# EasyEDA Pro project Laser Monitor.eprj, schematic Main Board Schematic

## Sheets
1 Pressure Transducer: Board Name: Main Board; Create Date: 2026-01-24; Page Name: Pressure Transducer; Project Name: Laser Monitor; Schematic Name: Main Board Schematic; Update Date: 2026-01-27
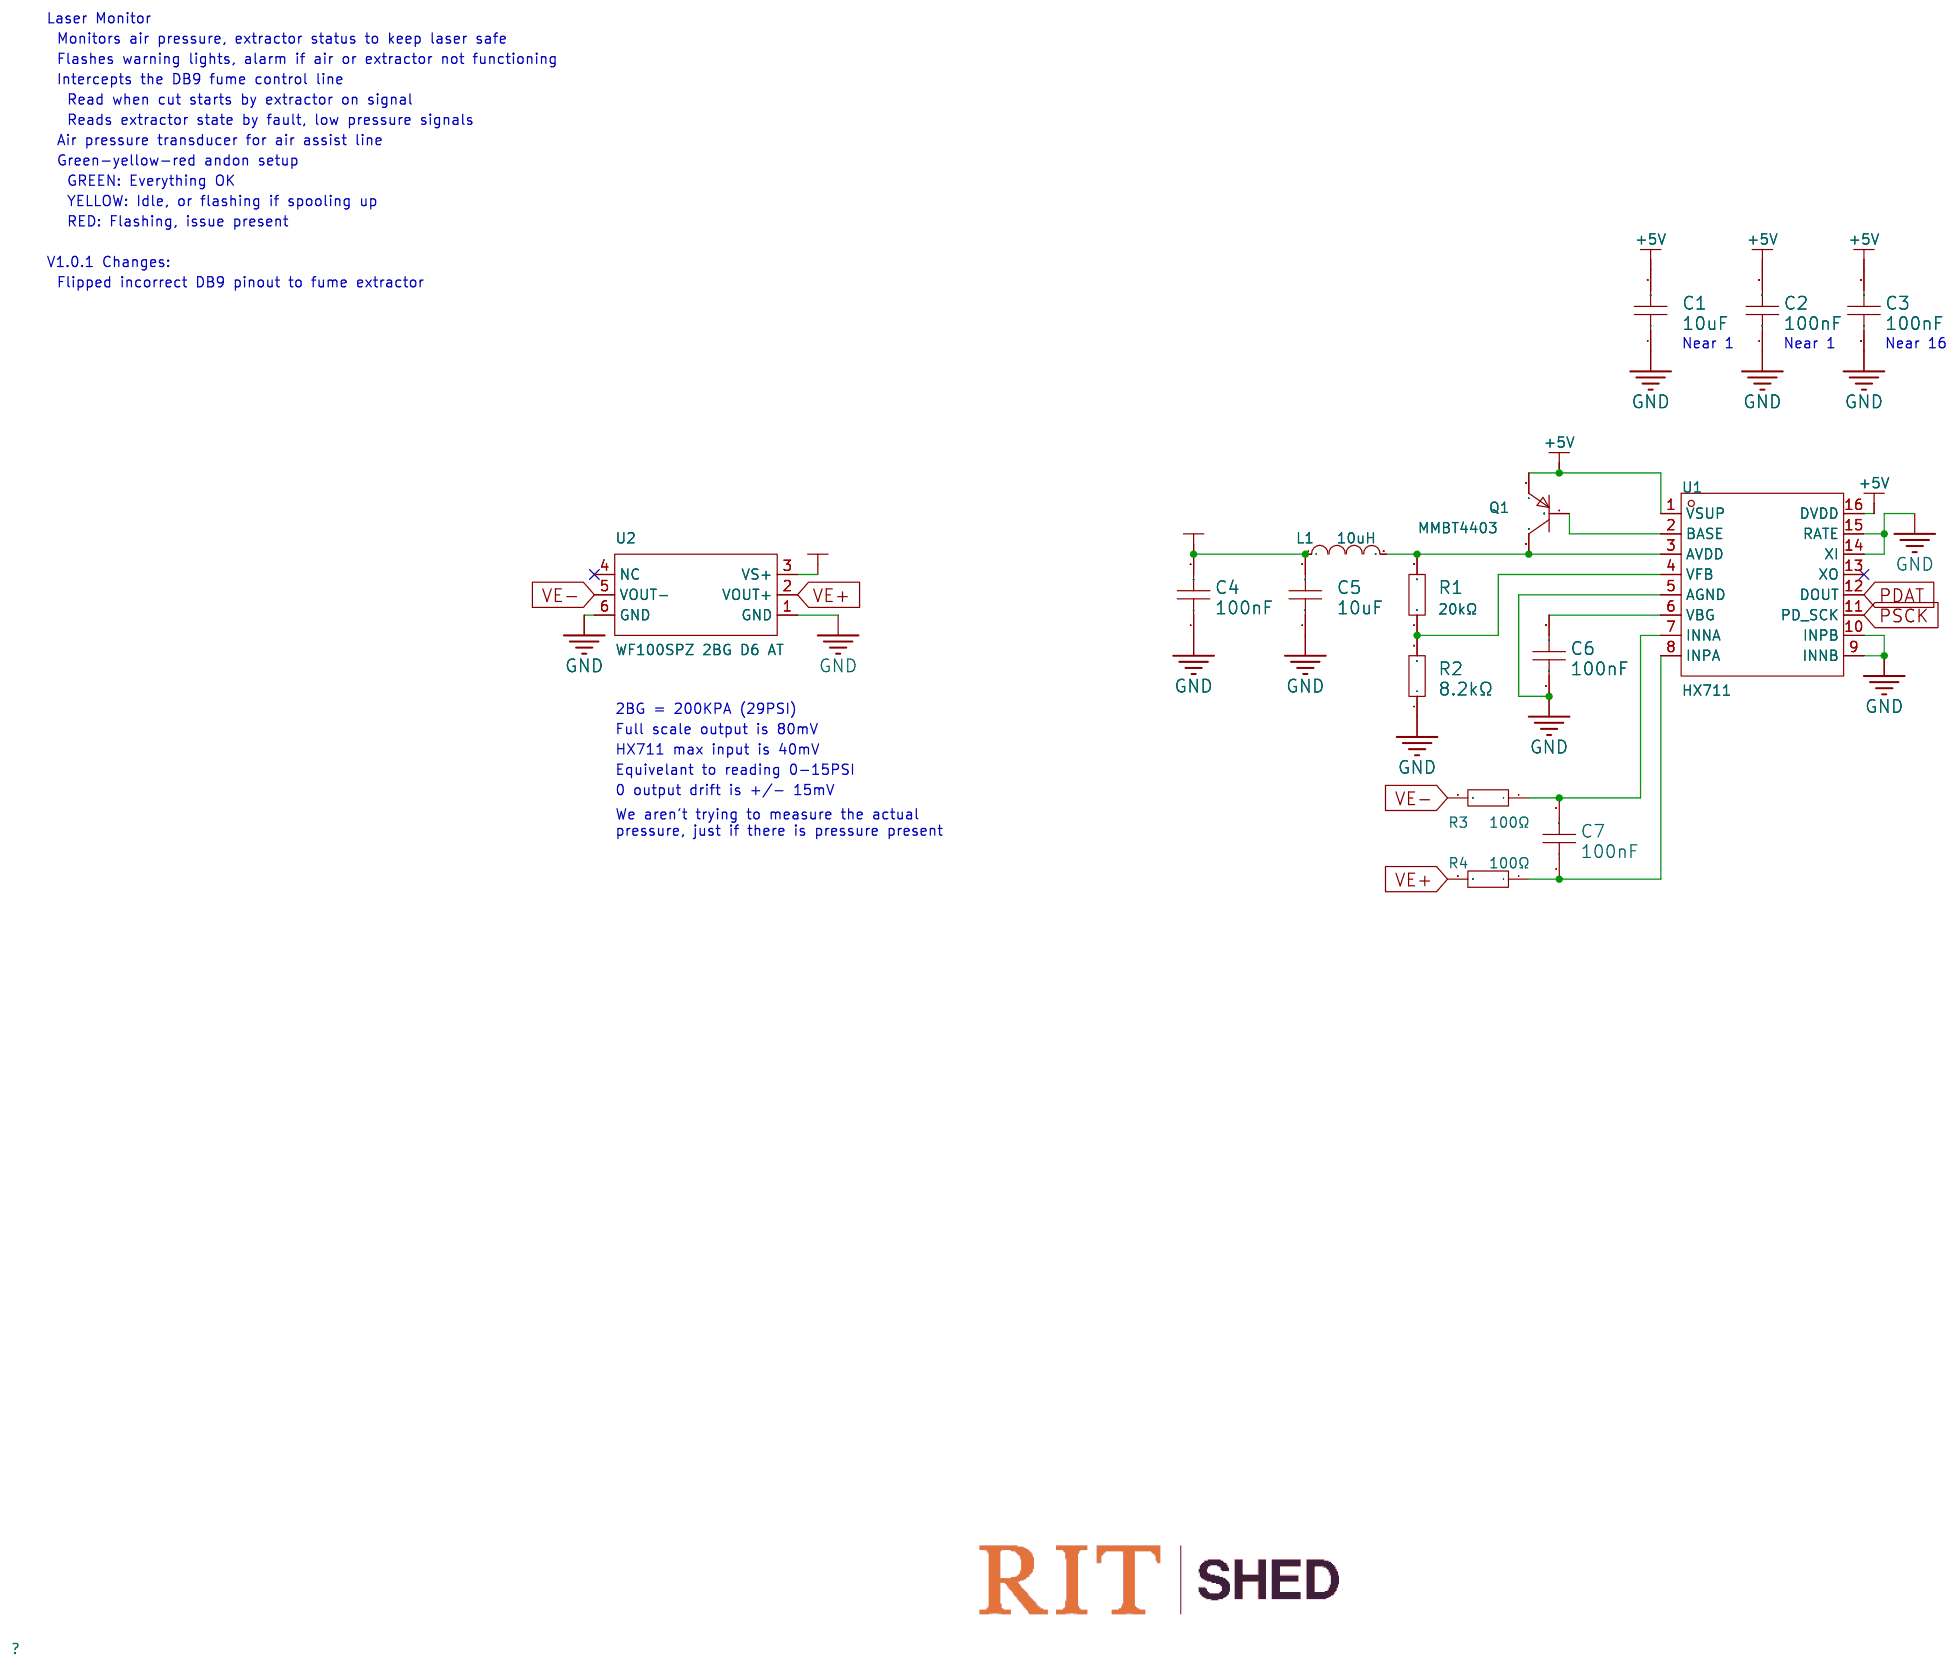
[diagram p0: Pressure Transducer]
2 Extractor Controls: Page Name: Extractor Controls
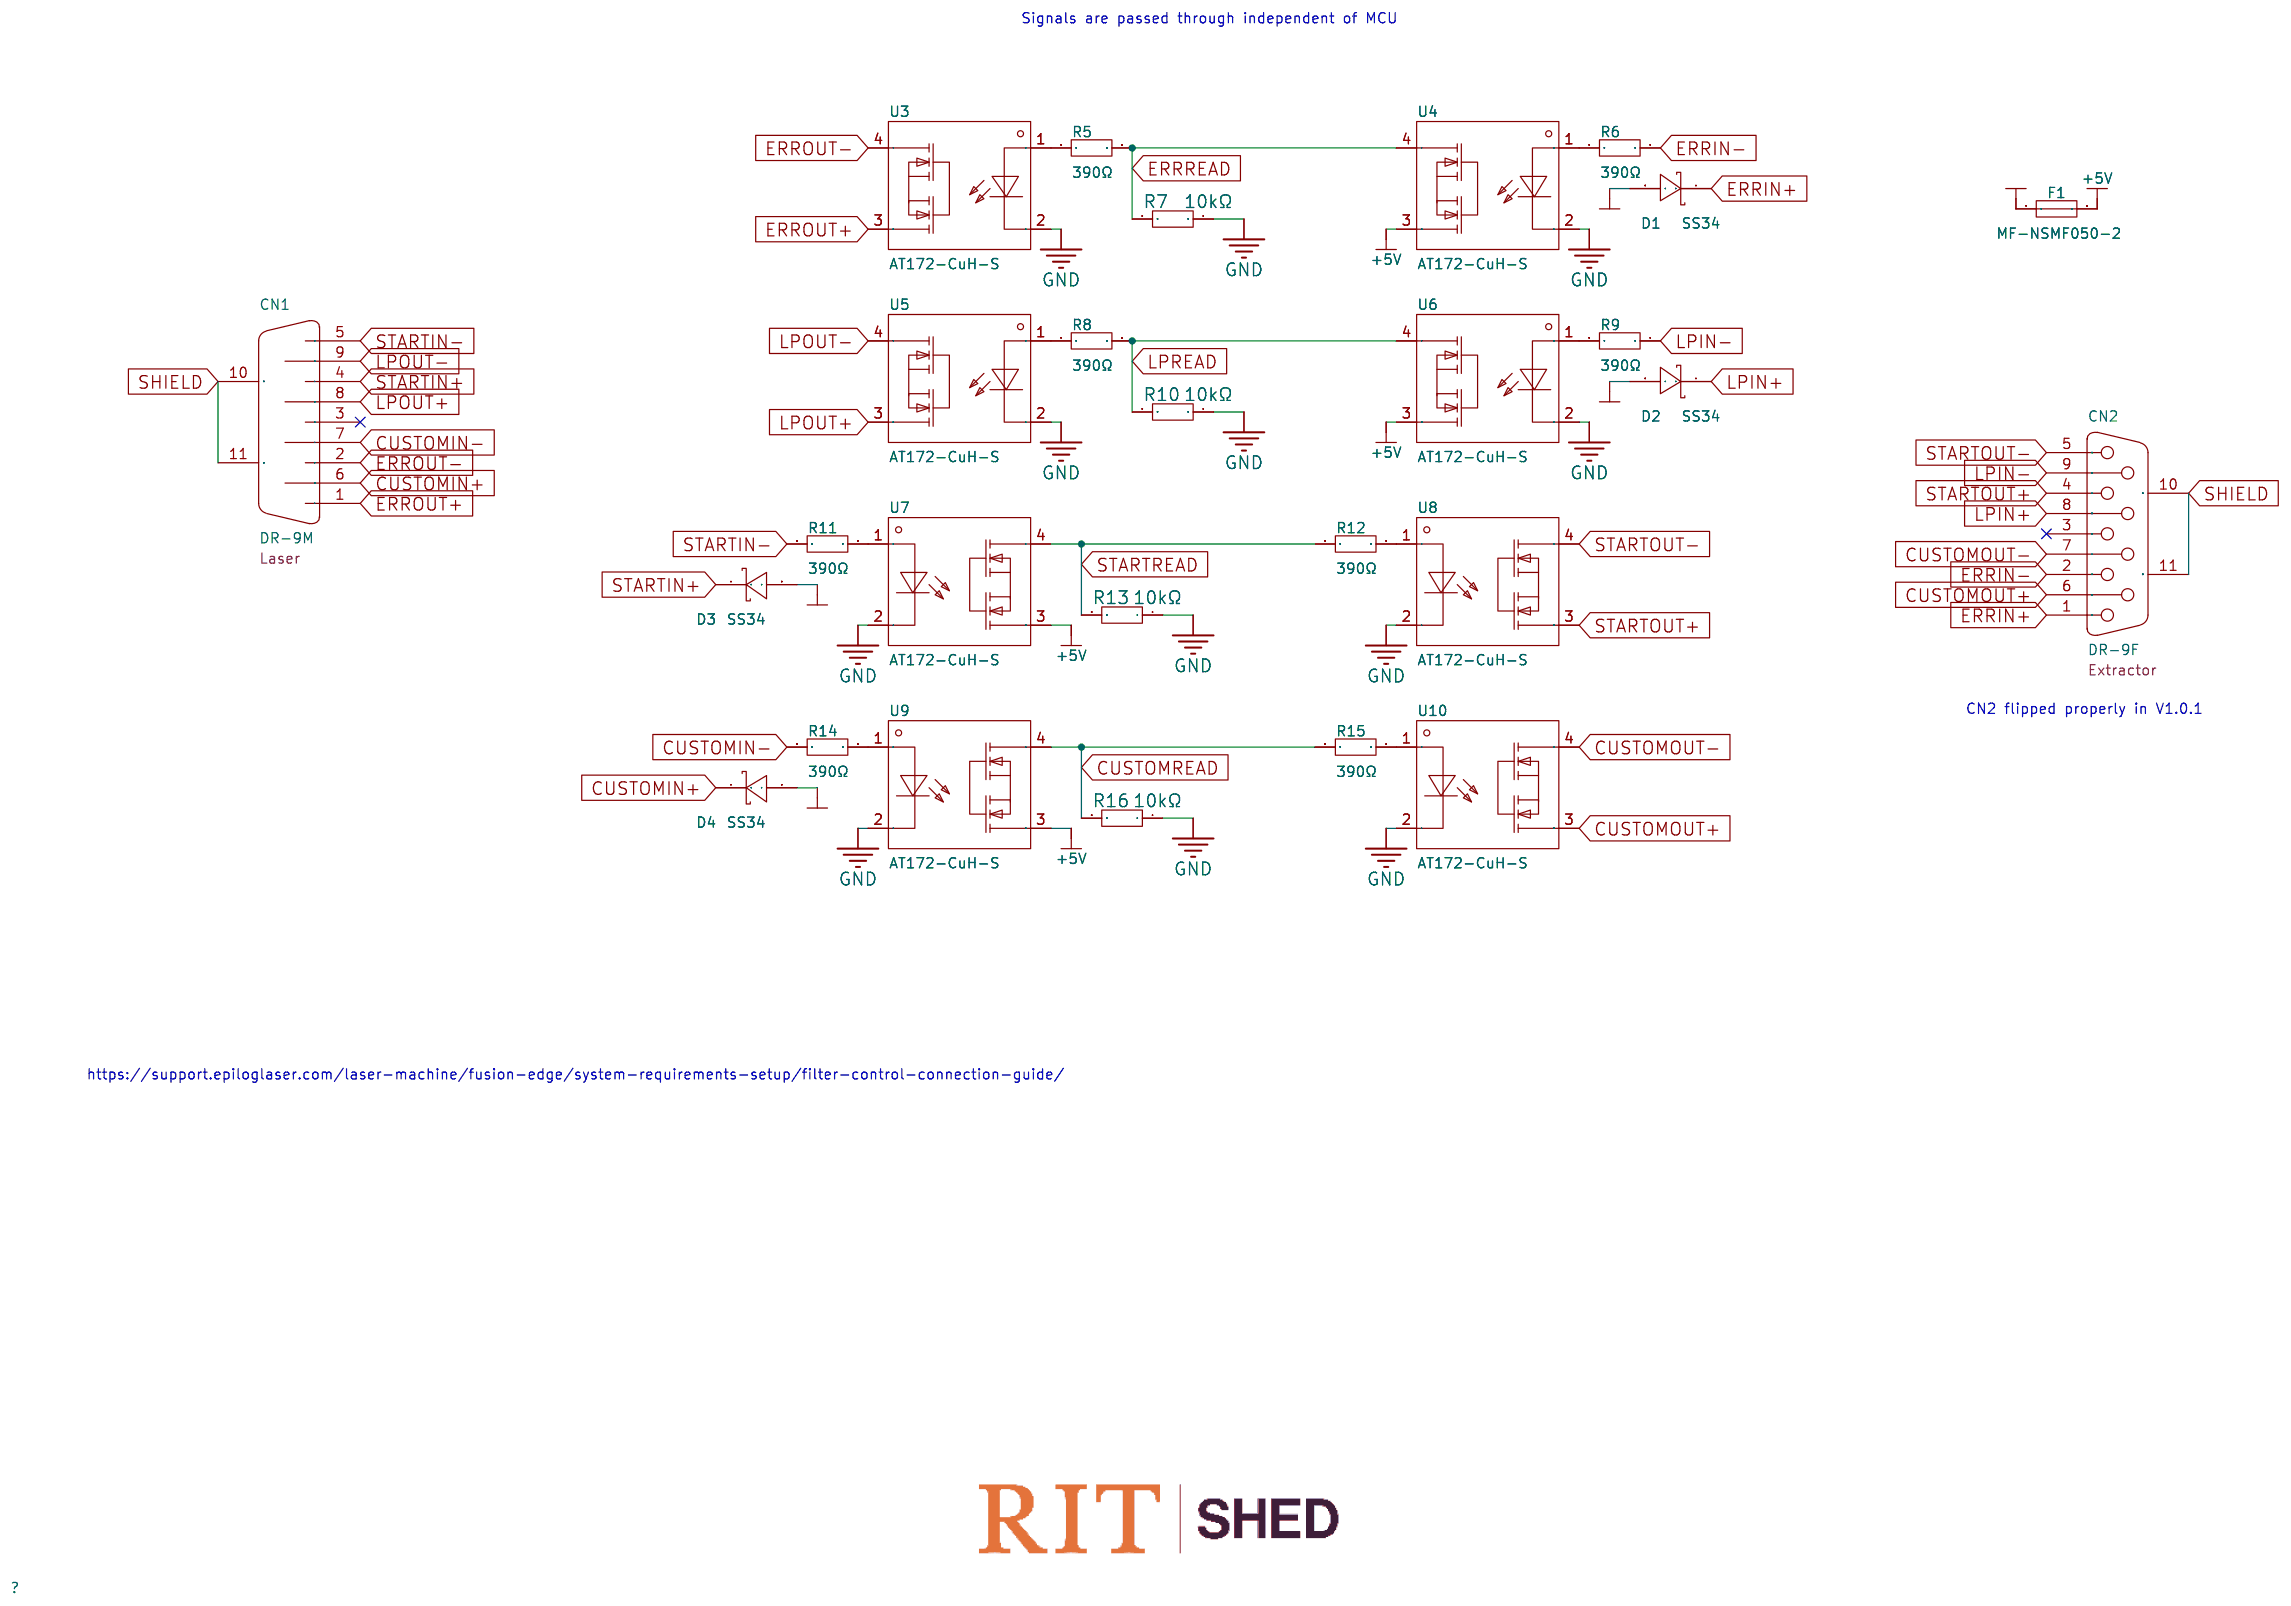
[diagram p1: Extractor Controls]
3 Andon Light: Board Name: <System Assignment>; Create Date: 2026-01-25; Page Name: Andon Light; Update Date: 2026-01-25
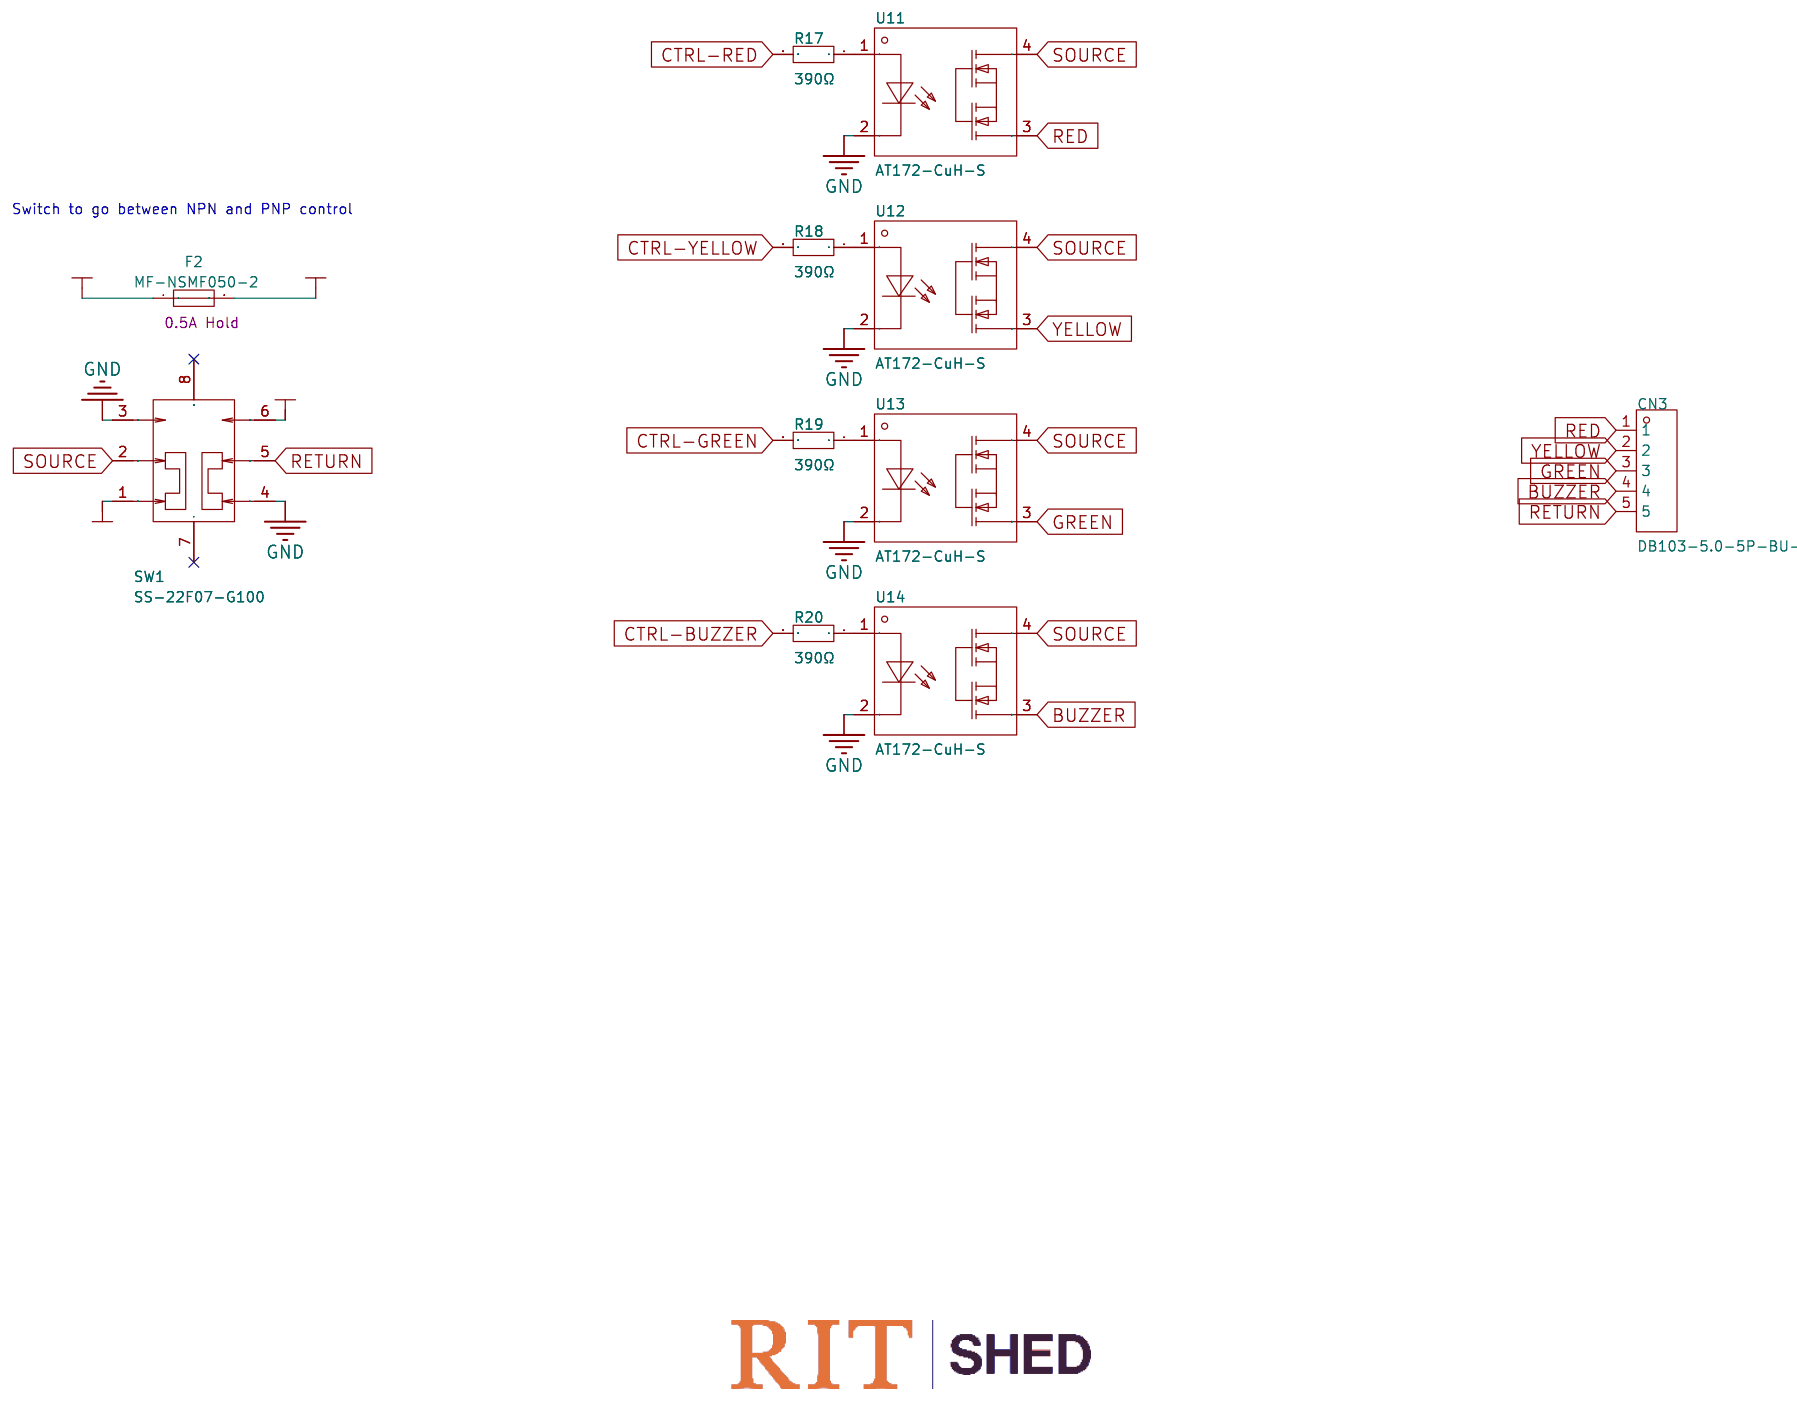
[diagram p2: Andon Light]
4 ACS Interface: Create Date: 2026-01-25; Page Name: ACS Interface
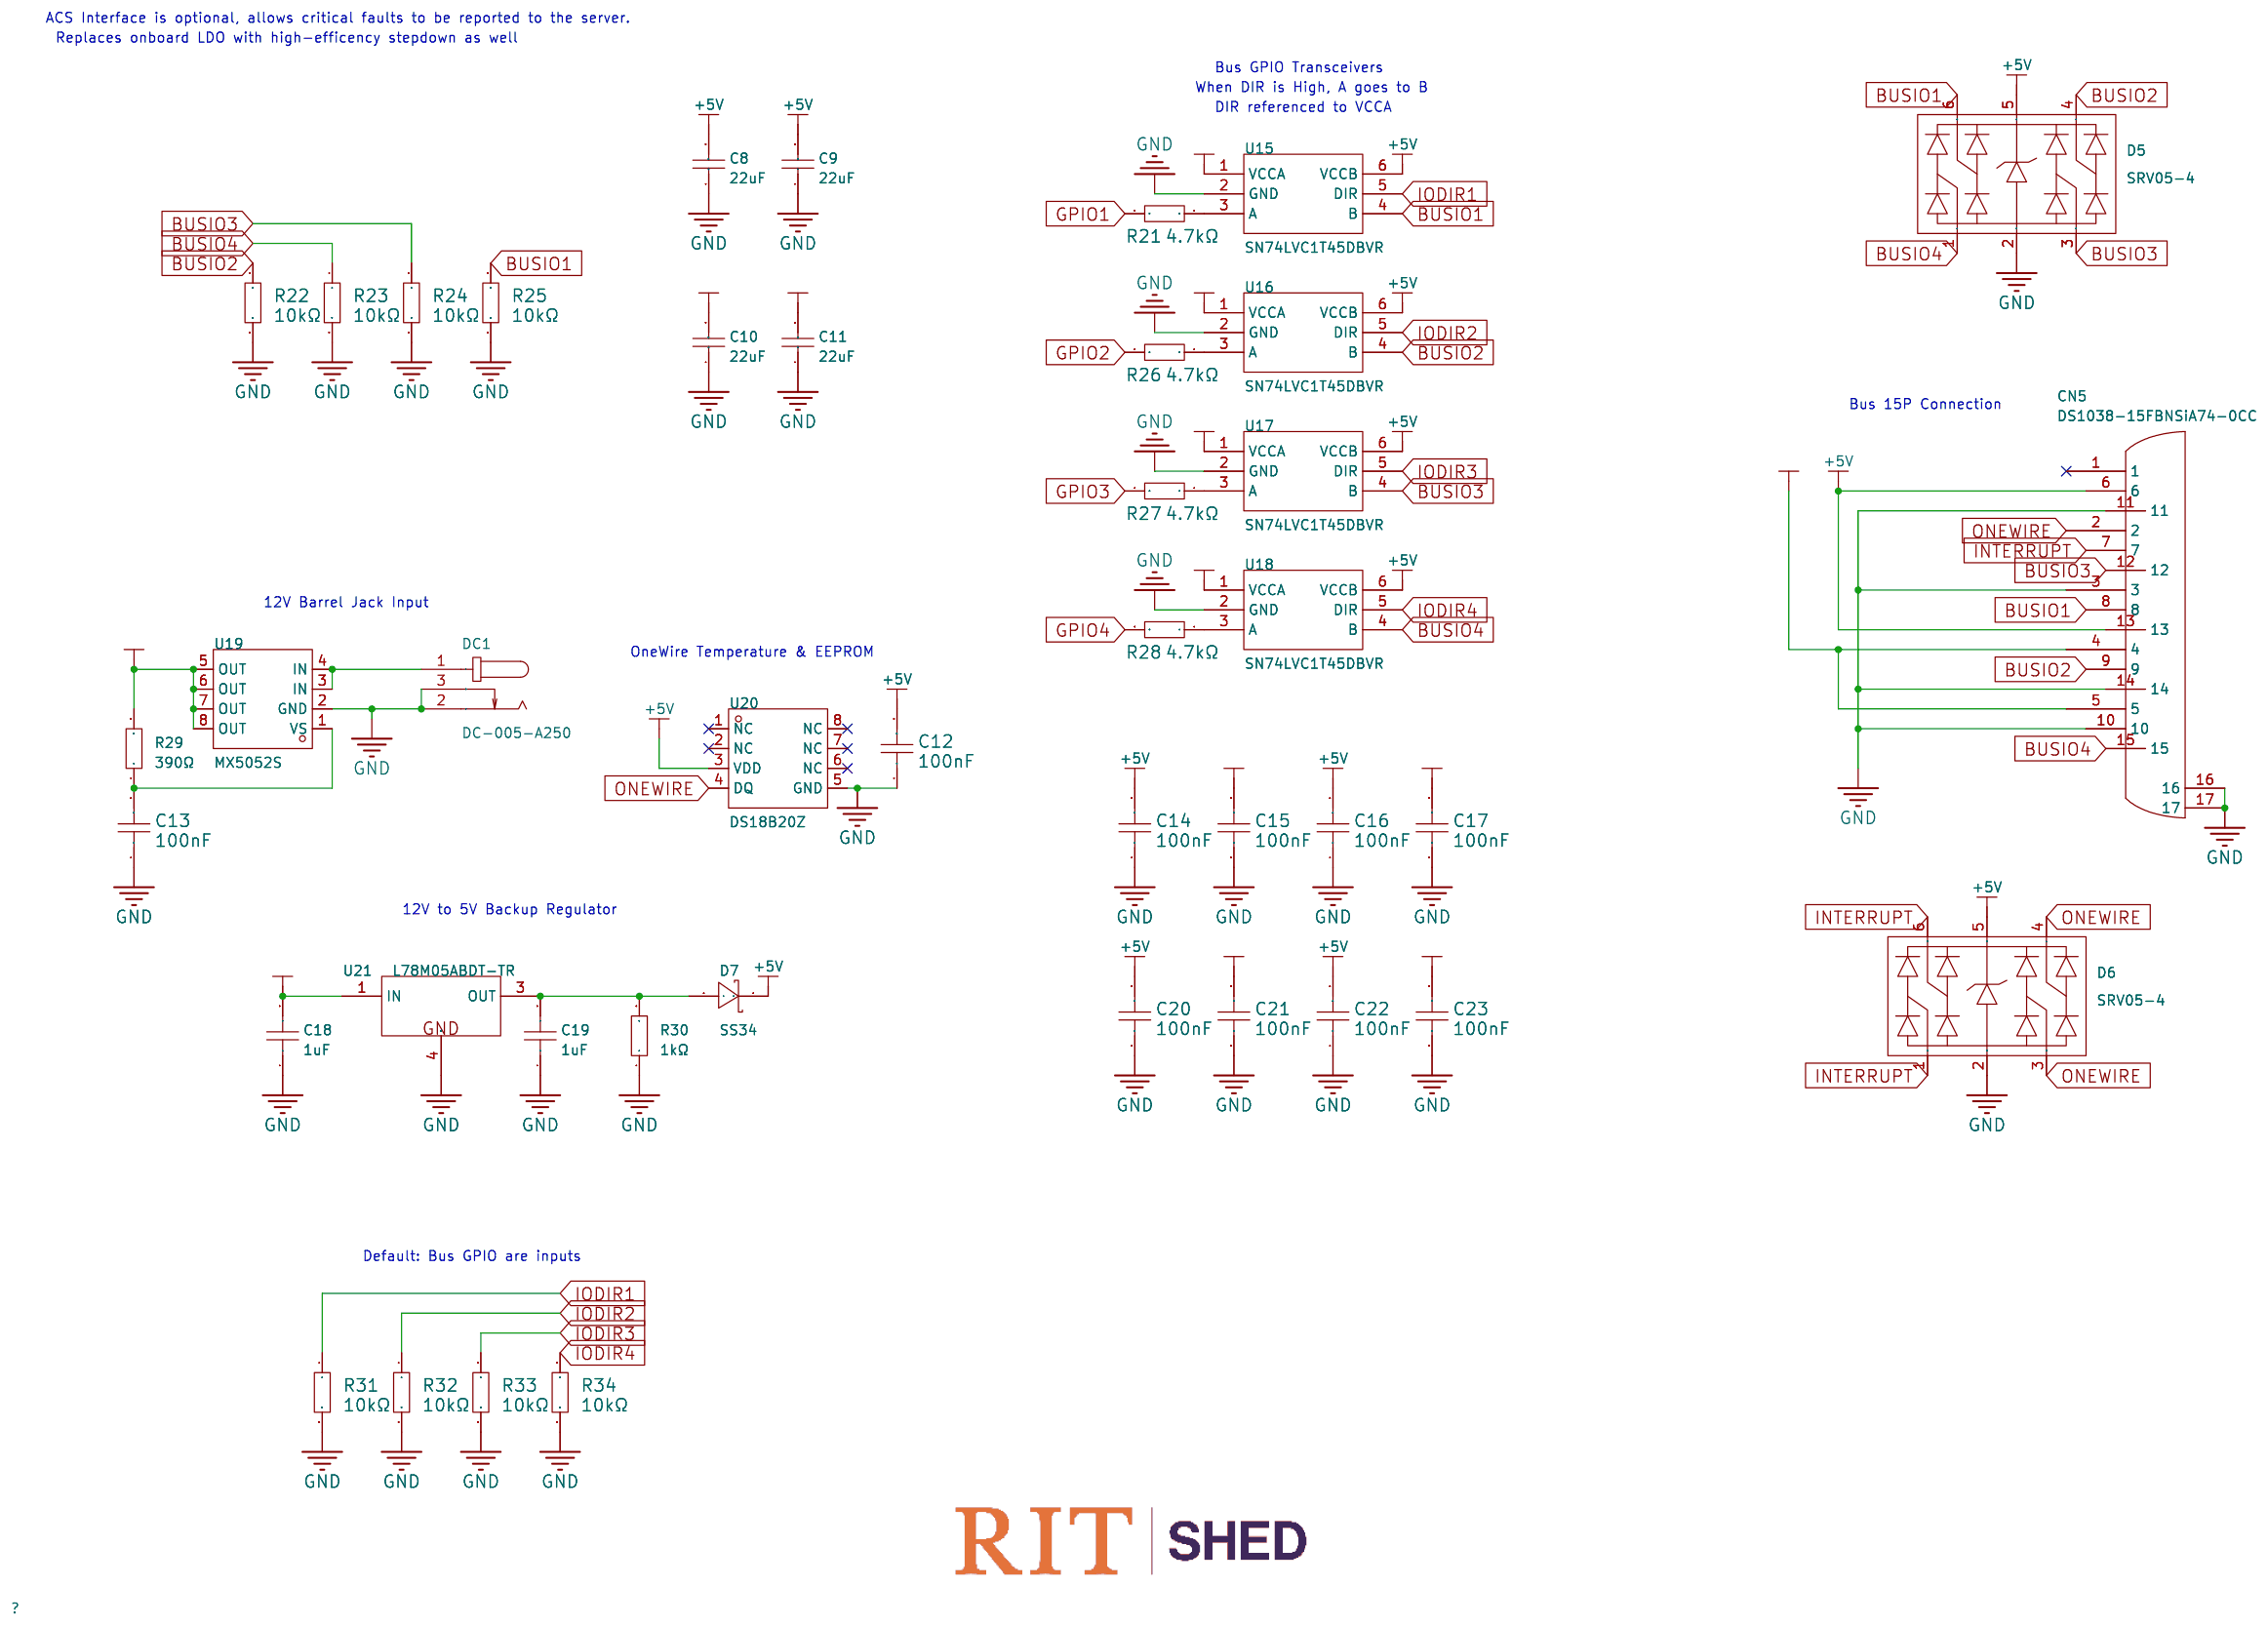
[diagram p3: ACS Interface]
5 Microcontroller: Board Name: <System Assignment>; Create Date: 2026-01-25; Page Name: Microcontroller; Update Date: 2026-01-26
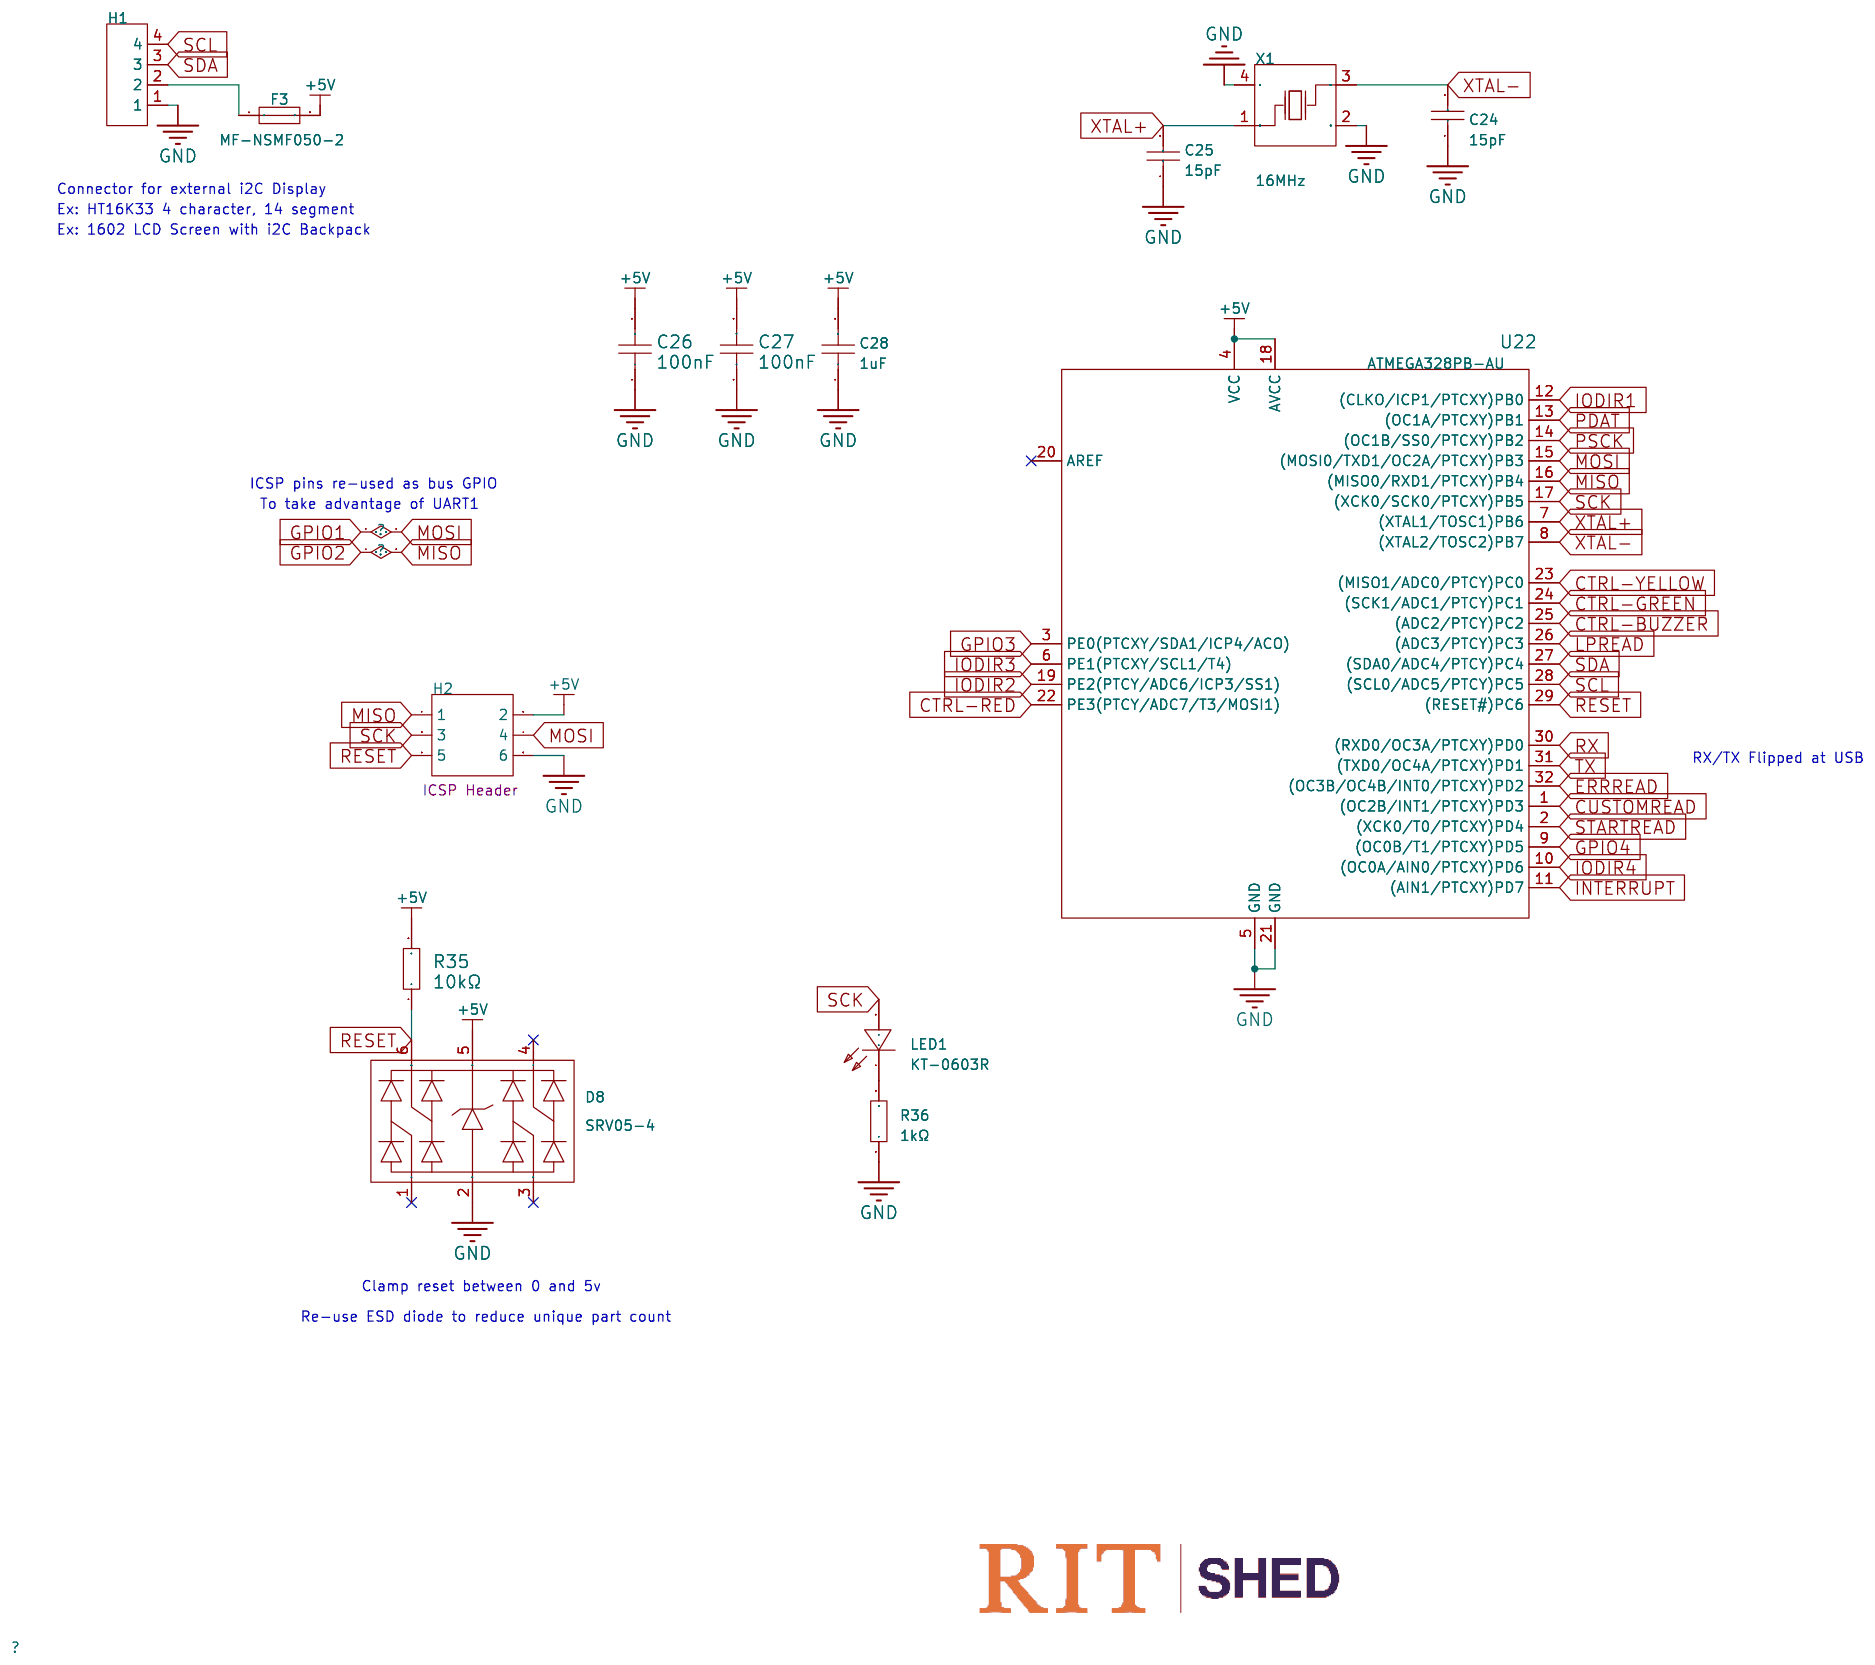
[diagram p4: Microcontroller]
6 USB-UART: Create Date: 2026-01-25; Page Name: USB-UART
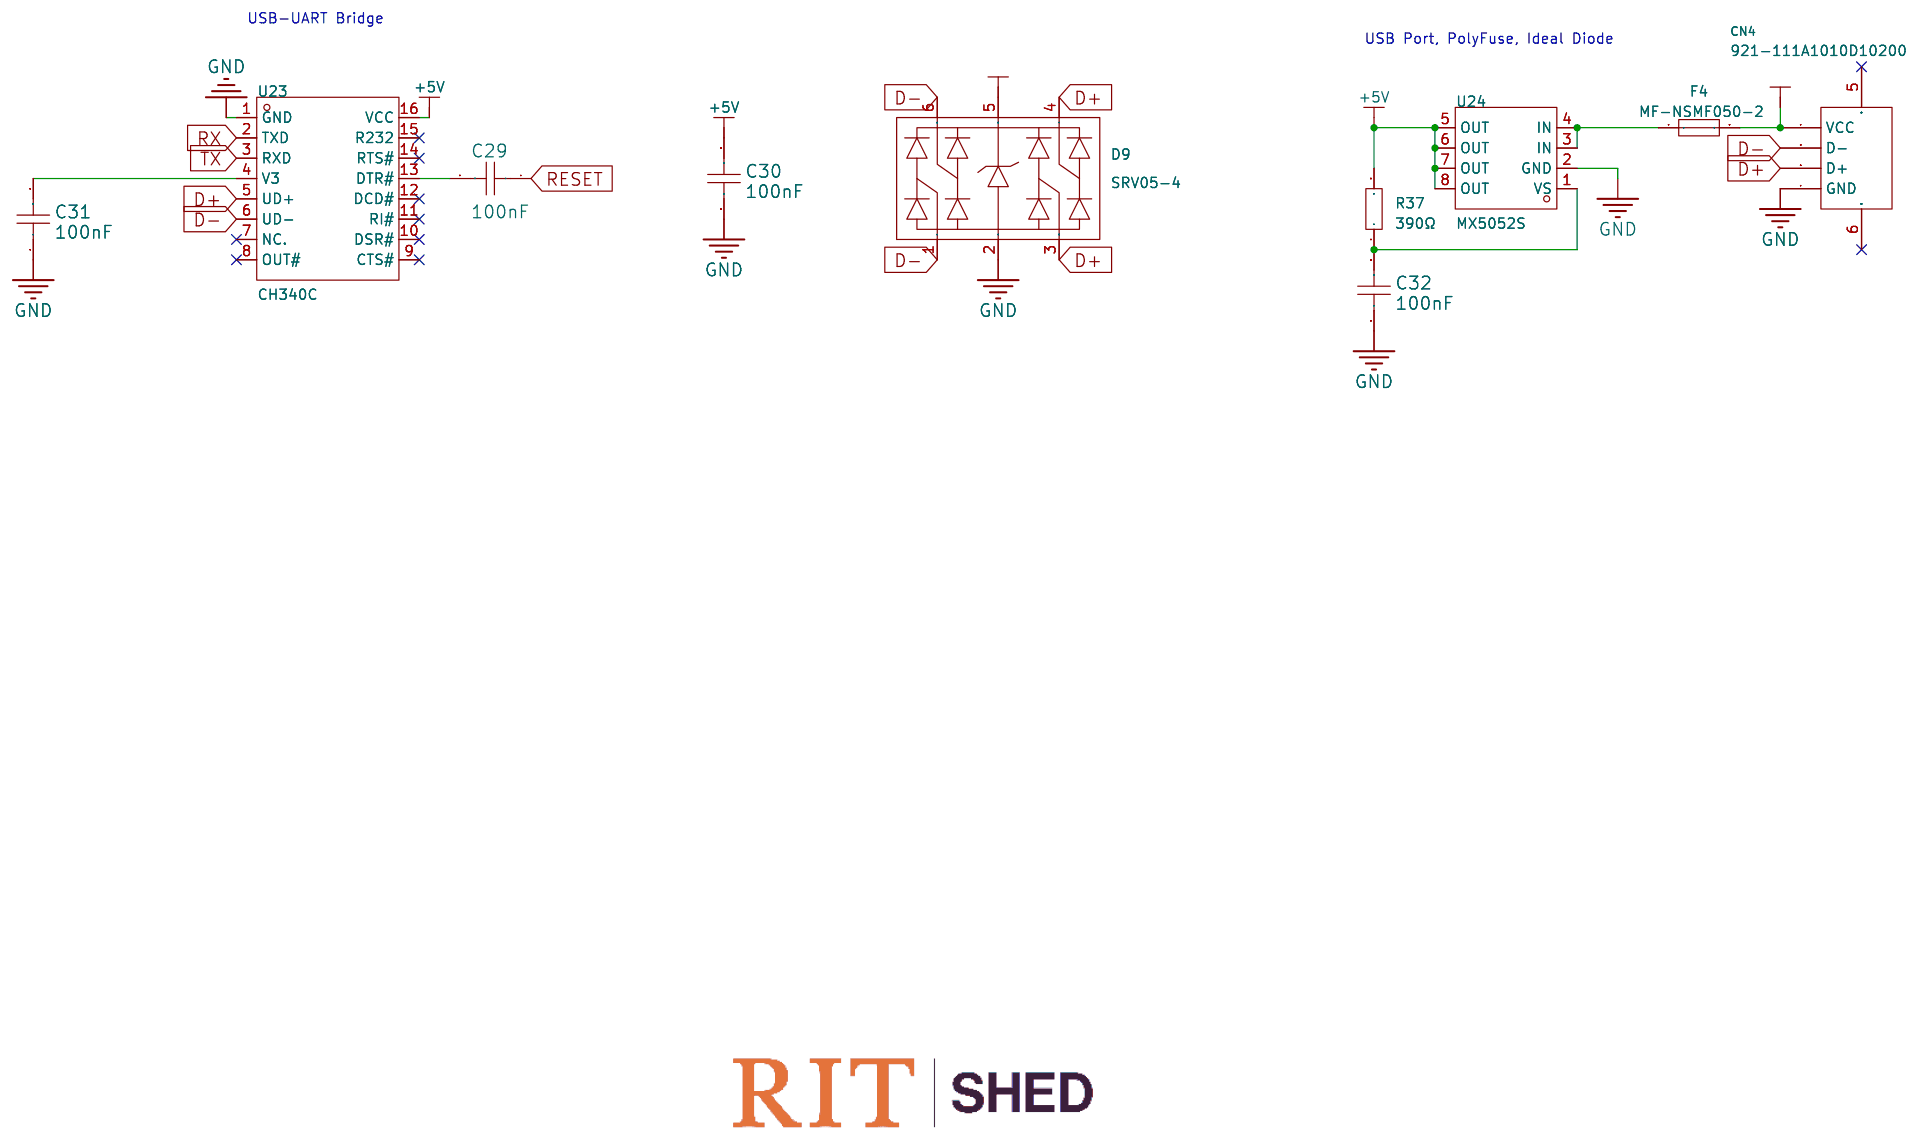
[diagram p5: USB-UART]

## Parts
sheet ACS Interface
C8  22uF  [C1206]
C9  22uF  [C1206]
C10  22uF  [C1206]
C11  22uF  [C1206]
C12  100nF  [C0603]
C13  100nF  [C0603]
C14  100nF  [C0603]
C15  100nF  [C0603]
C16  100nF  [C0603]
C17  100nF  [C0603]
C18  1uF  [C0603]
C19  1uF  [C0603]
C20  100nF  [C0603]
C21  100nF  [C0603]
C22  100nF  [C0603]
C23  100nF  [C0603]
CN5  DS1038-15FBNSiA74-0CC  [DSUB-TH_DS1038-15FBNSIA74-0CC]
D5  SRV05-4  [SOT-23-6_L2.9-W1.6-P0.95-LS2.8-BL]
D6  SRV05-4  [SOT-23-6_L2.9-W1.6-P0.95-LS2.8-BL]
D7  SS34  [SMA_L4.3-W2.6-LS5.2-RD]
DC1  DC-005-A250  [DC-IN-TH_DC-005-A250]
R21  4.7kΩ  [R0603]
R22  10kΩ  [R0603]
R23  10kΩ  [R0603]
R24  10kΩ  [R0603]
R25  10kΩ  [R0603]
R26  4.7kΩ  [R0603]
R27  4.7kΩ  [R0603]
R28  4.7kΩ  [R0603]
R29  390Ω  [R0805]
R30  1kΩ  [R0603]
R31  10kΩ  [R0603]
R32  10kΩ  [R0603]
R33  10kΩ  [R0603]
R34  10kΩ  [R0603]
U15  SN74LVC1T45DBVR  [SOT-23-6_L2.9-W1.6-P0.95-LS2.8-BR]
U16  SN74LVC1T45DBVR  [SOT-23-6_L2.9-W1.6-P0.95-LS2.8-BR]
U17  SN74LVC1T45DBVR  [SOT-23-6_L2.9-W1.6-P0.95-LS2.8-BR]
U18  SN74LVC1T45DBVR  [SOT-23-6_L2.9-W1.6-P0.95-LS2.8-BR]
U19  MX5052S  [SOP-8_L4.9-W3.9-P1.27-LS6.0-BL]
U20  DS18B20Z  [SOP-8_L4.9-W3.9-P1.27-LS6.0-BL]
U21  L78M05ABDT-TR  [TO-252-2_L6.5-W6.1-P4.58-LS10.0-TL]
sheet Andon Light
CN3  DB103-5.0-5P-BU-S  [CONN-TH_5P-P5.00_DB103-5.0-5P-BU-S]
F2  MF-NSMF050-2  [F1206]
R17  390Ω  [R0805]
R18  390Ω  [R0805]
R19  390Ω  [R0805]
R20  390Ω  [R0805]
SW1  SS-22F07-G100  [SW-TH_6P-L16.5-W7.5-P4.0-LS2.6-TL]
U11  AT172-CuH-S  [SOP-4_L4.6-W4.2-P2.54-LS7.1-BL]
U12  AT172-CuH-S  [SOP-4_L4.6-W4.2-P2.54-LS7.1-BL]
U13  AT172-CuH-S  [SOP-4_L4.6-W4.2-P2.54-LS7.1-BL]
U14  AT172-CuH-S  [SOP-4_L4.6-W4.2-P2.54-LS7.1-BL]
sheet Extractor Controls
CN1  DR-9M  [DR9-TH_ZHOUR_DR-9P-R]
CN2  DR-9F  [DR9-TH_ZHOUR_DR-9P-L]
D1  SS34  [SMA_L4.3-W2.6-LS5.2-RD]
D2  SS34  [SMA_L4.3-W2.6-LS5.2-RD]
D3  SS34  [SMA_L4.3-W2.6-LS5.2-RD]
D4  SS34  [SMA_L4.3-W2.6-LS5.2-RD]
F1  MF-NSMF050-2  [F1206]
R5  390Ω  [R0805]
R6  390Ω  [R0805]
R7  10kΩ  [R0603]
R8  390Ω  [R0805]
R9  390Ω  [R0805]
R10  10kΩ  [R0603]
R11  390Ω  [R0805]
R12  390Ω  [R0805]
R13  10kΩ  [R0603]
R14  390Ω  [R0805]
R15  390Ω  [R0805]
R16  10kΩ  [R0603]
U3  AT172-CuH-S  [SOP-4_L4.6-W4.2-P2.54-LS7.1-BL]
U4  AT172-CuH-S  [SOP-4_L4.6-W4.2-P2.54-LS7.1-BL]
U5  AT172-CuH-S  [SOP-4_L4.6-W4.2-P2.54-LS7.1-BL]
U6  AT172-CuH-S  [SOP-4_L4.6-W4.2-P2.54-LS7.1-BL]
U7  AT172-CuH-S  [SOP-4_L4.6-W4.2-P2.54-LS7.1-BL]
U8  AT172-CuH-S  [SOP-4_L4.6-W4.2-P2.54-LS7.1-BL]
U9  AT172-CuH-S  [SOP-4_L4.6-W4.2-P2.54-LS7.1-BL]
U10  AT172-CuH-S  [SOP-4_L4.6-W4.2-P2.54-LS7.1-BL]
sheet Microcontroller
C24  15pF  [C0603]
C25  15pF  [C0603]
C26  100nF  [C0603]
C27  100nF  [C0603]
C28  1uF  [C0603]
D8  SRV05-4  [SOT-23-6_L2.9-W1.6-P0.95-LS2.8-BL]
F3  MF-NSMF050-2  [F1206]
H1  -  [HDR-TH_4P-P2.54-V-M]
H2  -  [HDR-TH_6P-P2.54-V-F-R2-C3-S2.54]
LED1  KT-0603R  [LED0603-RD]
R35  10kΩ  [R0603]
R36  1kΩ  [R0603]
U22  ATMEGA328PB-AU  [TQFP-32_L7.0-W7.0-P0.80-LS9.0-BL]
X1  16MHz  [OSC-SMD_4P-L3.2-W2.5-BL]
sheet Pressure Transducer
C1  10uF  [C0603]
C2  100nF  [C0603]
C3  100nF  [C0603]
C4  100nF  [C0603]
C5  10uF  [C0603]
C6  100nF  [C0603]
C7  100nF  [C0603]
L1  10uH  [L1206]
Q1  MMBT4403  [SOT-23-3_L2.9-W1.3-P0.95-LS2.4-BR]
R1  20kΩ  [R0603]
R2  8.2kΩ  [R0603]
R3  100Ω  [R0603]
R4  100Ω  [R0603]
U1  HX711  [SOP-16_L10.0-W3.9-P1.27-LS6.0-BL]
U2  WF100SPZ 2BG D6 AT  [DIP-6_L8.5-W8.5-P2.54-LS10.2-TL]
sheet USB-UART
C29  100nF  [C0603]
C30  100nF  [C0603]
C31  100nF  [C0603]
C32  100nF  [C0603]
CN4  921-111A1010D10200  [USB-B_TH_USB-B-FEMALE-90]
D9  SRV05-4  [SOT-23-6_L2.9-W1.6-P0.95-LS2.8-BL]
F4  MF-NSMF050-2  [F1206]
R37  390Ω  [R0805]
U23  CH340C  [SOP-16_L10.0-W3.9-P1.27-LS6.0-BL]
U24  MX5052S  [SOP-8_L4.9-W3.9-P1.27-LS6.0-BL]

## Library data of the parts
C8-C11 = CL31A226KAHNNNE: LCSC Part Name: 22uF ±10% 25V; Supplier Part: C12891; Manufacturer: SAMSUNG(三星); Supplier Footprint: 1206; JLCPCB Part Class: Basic Part; Datasheet: https://item.szlcsc.com/datasheet/CL31A226KAHNNNE/13537.html; Supplier: LCSC; Tolerance: ±10%; Voltage Rating: 25V; Temperature Coefficient: X5R
C2-C4 C6 C7 C12-C17 C20-C23 C26 C27 C29-C32 = CC0603KRX7R9BB104: Capacitance: Tolerance:±10% Tolerance:±10% Voltage Rated: Temperature Coefficient:; LCSC Part Name: 100nF ±10% 50V; Supplier Part: C14663; Manufacturer: YAGEO(国巨); Supplier Footprint: 0603; JLCPCB Part Class: Basic Part; Datasheet: https://atta.szlcsc.com/upload/public/pdf/source/20180910/C282072_33301C7F631E79921B82A8DAC6BCC5B3.pdf; Supplier: LCSC; Tolerance: ±10%
C18 C19 C28 = CL10A105KB8NNNC: LCSC Part Name: 1uF ±10% 50V; Supplier Part: C15849; Manufacturer: SAMSUNG(三星); Supplier Footprint: 0603; JLCPCB Part Class: Basic Part; Datasheet: https://item.szlcsc.com/datasheet/CL10A105KB8NNNC/16531.html; Supplier: LCSC; Tolerance: ±10%; Voltage Rating: 50V; Temperature Coefficient: X5R
CN5 = DS1038-15FBNSiA74-0CC: Connector Type:High Density D-Sub Gender:Female Number of Pins:15P Mounting Type:Right Angle Number of Rows:3 Current Rating-Signal:3A Current Rating-Power:- Voltage Rating:- Color:Black Operating Temperature:-40℃~+105℃ Operating Temperature:-40℃~+105℃; LCSC Part Name: 黑色 1000/盒 D-Sub 母 P数:15P; Supplier Part: C75754; Manufacturer: CONNFLY; Supplier Footprint: 弯插; JLCPCB Part Class: Extended Part; Datasheet: https://item.szlcsc.com/datasheet/DS1038-15FBNSiA74-0CC/76880.html; Supplier: LCSC; Connector Type: High Density D-Sub; Gender: Female; Number of Pins: 15P; Mounting Type: Right Angle; Number of Rows: 3; Current Rating-Signal: 3A; Color: Black; Operating Temperature: -40℃~+105℃
D5 D6 D8 D9 = SRV05-4_C558418: polarity:Unidirectional Reverse Stand-Off Voltage (Vrwm):5V Maximum Clamping Voltage:20V Peak Pulse Current (Ipp):3A Peak Pulse Power Dissipation (Ppp):60W Breakdown Voltage:6V Reverse Leakage Current (Ir):500nA Number of Lines:Four channels Operating Tem; LCSC Part Name: ESD，可防25kV静电; Supplier Part: C558418; Manufacturer: TECH PUBLIC(台舟); Supplier Footprint: SOT-23-6; JLCPCB Part Class: Extended Part; Datasheet: https://atta.szlcsc.com/upload/public/pdf/source/20230615/CFFDFFE99FDA0E92DF9600783B3A2A20.pdf; Supplier: LCSC; polarity: Unidirectional; Reverse Stand-Off Voltage (Vrwm): 5V; Maximum Clamping Voltage: 20V; Peak Pulse Current (Ipp): 3A; Peak Pulse Power Dissipation (Ppp): 60W; Breakdown Voltage: 6V; Reverse Leakage Current (Ir): 500nA; Number of Lines: Four channels; Operating Temperature: -55℃~+125℃; level of protection: IEC 61000-4-2; Type: ESD
D1-D4 D7 = SS34_C8678: LCSC Part Name: 电压:40V 电流:3A; Supplier Part: C8678; Manufacturer: MDD(辰达半导体); Supplier Footprint: SMA(DO-214AC); Datasheet: https://item.szlcsc.com/datasheet/SS34/9178.html; Supplier: LCSC; Diode Configuration: Independent; Voltage - Forward(Vf@If): 550mV@3A; Voltage - DC Reverse(Vr): 40V; Current - Rectified: 3A; Reverse Leakage Current (Ir): 500uA@40V; Operating Junction Temperature Range: -55℃~+125℃
DC1 = DC-005-A250: LCSC Part Name: DC电源插座 内径:2.5mm; Supplier Part: C720558; Manufacturer: XUNPU(讯普); Supplier Footprint: 插件; JLCPCB Part Class: Extended Part; Datasheet: https://item.szlcsc.com/datasheet/DC-005-A250/763565.html; Supplier: LCSC; Connector Type: DC Power Jack; Mounting Type: Right Angle; Inside Contact Diameter: 2.5mm; Outside Contact Diameter: 6.4mm; Current Rating: 5A; Voltage Rating (Max): 24V; Operating Temperature: -20℃~+70℃
R21 R26-R28 = 0603WAF4701T5E: Type:Thick Film Resistors Resistance:4.7kΩ Tolerance:±1% Tolerance:±1% Power(Watts): Overload Voltage (Max): Temperature Coefficient:±100ppm/℃ Temperature Coefficient:±100ppm/℃ Operating Temperature Range:-55℃~+155℃ Operating Temperature Range:-55℃~+155℃; LCSC Part Name: 4.7kΩ ±1% 100mW 厚膜电阻; Supplier Part: C23162; Manufacturer: UNI-ROYAL(厚声); Supplier Footprint: 0603; JLCPCB Part Class: Basic Part; Datasheet: https://atta.szlcsc.com/upload/public/pdf/source/20200306/C422600_1E6D84923E4A46A82E41ADD87F860B5C.pdf; Supplier: LCSC; Type: Thick Film Resistors; Tolerance: ±1%; Temperature Coefficient: ±100ppm/℃; Operating Temperature Range: -55℃~+155℃
R7 R10 R13 R16 R22-R25 R31-R35 = 0603WAF1002T5E: Type:Thick Film Resistors Resistance:10kΩ Tolerance:±1% Tolerance:±1% Power(Watts): Overload Voltage (Max): Temperature Coefficient:±100ppm/℃ Temperature Coefficient:±100ppm/℃ Operating Temperature Range:-55℃~+155℃ Operating Temperature Range:-55℃~+155℃; LCSC Part Name: 厚膜电阻 10kΩ ±1% 100mW; Supplier Part: C25804; Manufacturer: UNI-ROYAL(厚声); Supplier Footprint: 0603; JLCPCB Part Class: Basic Part; Datasheet: https://atta.szlcsc.com/upload/public/pdf/source/20200306/C422600_1E6D84923E4A46A82E41ADD87F860B5C.pdf; Supplier: LCSC; Type: Thick Film Resistors; Tolerance: ±1%; Temperature Coefficient: ±100ppm/℃; Operating Temperature Range: -55℃~+155℃
R5 R6 R8 R9 R11 R12 R14 R15 R17-R20 R29 R37 = 0805W8F3900T5E: Type:Thick Film Resistor Resistance:390Ω Tolerance:±1% Tolerance:±1% Power(Watts):125mW Voltage-Supply(Max):150V Temperature Coefficient:±100ppm/℃ Temperature Coefficient:±100ppm/℃ Operating Temperature:-55℃~+155℃ Operating Temperature:-55℃~+155℃; LCSC Part Name: 390Ω ±1% 125mW 厚膜电阻; Supplier Part: C17655; Manufacturer: UNI-ROYAL(厚声); Supplier Footprint: 0805; Datasheet: https://item.szlcsc.com/datasheet/0805W8F3900T5E/18343.html; Supplier: LCSC; Type: Thick Film Resistor; Tolerance: ±1%; Power(Watts): 125mW; Voltage-Supply(Max): 150V; Temperature Coefficient: ±100ppm/℃; Operating Temperature: -55℃~+155℃
R30 R36 = 0603WAF1001T5E: LCSC Part Name: 1kΩ ±1% 100mW 厚膜电阻; Supplier Part: C21190; Manufacturer: UNI-ROYAL(厚声); Supplier Footprint: 0603; JLCPCB Part Class: Basic Part; Datasheet: https://item.szlcsc.com/datasheet/0603WAF1001T5E/21904.html; Supplier: LCSC; Type: Thick Film Resistor; Tolerance: ±1%; Power(Watts): 100mW; Voltage-Supply(Max): 75V; Temperature Coefficient: ±100ppm/℃; Operating Temperature: -55℃~+155℃
U15-U18 = SN74LVC1T45DBVR: Channel Type:Bidirectional Data Rate:420Mbps Voltage - Supply(VCCA):1.65V~5.5V Voltage - Supply(VCCA):1.65V~5.5V Voltage - Supply(VCCB):1.65V~5.5V Voltage - Supply(VCCB):1.65V~5.5V Number of Circuits:1 Number of Circuits:1 Output Type:Tri-State Operating; Supplier Part: C7843; Manufacturer: TI(德州仪器); Supplier Footprint: SOT-23-6; Datasheet: https://www.ti.com/cn/lit/gpn/sn74lvc1t45; Supplier: LCSC; Channel Type: Bidirectional; Data Rate: 420Mbps; Voltage - Supply(VCCA): 1.65V~5.5V; Voltage - Supply(VCCB): 1.65V~5.5V; Number of Circuits: 1; Output Type: Tri-State; Operating Temperature: -40℃~+85℃
U19 U24 = MX5052S: LCSC Part Name: 集成MOS Oring控制器; Supplier Part: C5875696; Manufacturer: Wuxi Maxinmicro(无锡明芯微); Supplier Footprint: SOP-8; JLCPCB Part Class: Extended Part; Datasheet: https://item.szlcsc.com/datasheet/MX5052S/6809525.html; Supplier: LCSC
U20 = DS18B20Z: Resolution:±0.4℃ Resolution:±0.4℃ Supply Voltage:2.5V~5.5V Supply Voltage:2.5V~5.5V; LCSC Part Name: 温度传感器; Supplier Part: C695837; Manufacturer: UMW(友台半导体); Supplier Footprint: SOIC-8; JLCPCB Part Class: Extended Part; Datasheet: https://atta.szlcsc.com/upload/public/pdf/source/20231109/DC3DA9D47D486EF40A6E0F08B9A498E3.pdf; Supplier: LCSC; Resolution: ±0.4℃; Supply Voltage: 2.5V~5.5V
U21 = L78M05ABDT-TR: LCSC Part Name: 5V 500mA 35V; Supplier Part: C58069; Manufacturer: ST(意法半导体); Supplier Footprint: TO-252-2(DPAK); JLCPCB Part Class: Basic Part; Datasheet: https://item.szlcsc.com/datasheet/L78M05ABDT-TR/59107.html; Supplier: LCSC; Output Type: Fixed; Voltage - Supply: 35V; Output Voltage: 5V; Output Current: 500mA; Power Supply Rejection Ratio (PSRR): 62dB@(120Hz); Voltage Dropout: 2V@(350mA); standby current: 6mA; Noise: 40uV; Features: Over Temperature Protection；Short Circuit Protection; Operating Temperature: -40℃~+125℃@(Tj); Output Configuration: Positive; Number of Outputs: 1
CN3 = DB103-5.0-5P-BU-S: LCSC Part Name: 1x5P 5mm 直插 排数:1 每排P数:5; Supplier Part: C430589; Manufacturer: DORABO(地博电气); Supplier Footprint: 插件,P=5mm; Datasheet: https://item.szlcsc.com/datasheet/DB103-5.0-5P-BU-S/426234.html; Supplier: LCSC; Number of Positions or Pins: 1x5P; Pitch: 5mm; Color: Blue; Mounting Type: Through Hole; Number of Pins: 5P; Number of Rows: 1; Number of PINs Per Row: 5; Current Rating: 16A; Voltage Rating (Max): 250V; Wire Gauge - AWG: 12~24; Wire Gauge - mm2: 2.5; Operating Temperature: -40℃~+105℃
F1 F2 = MF-NSMF050-2: Voltage - Max:- Current - Max:- Hold Current:- Trip Current:- Resistance - Initial (Ri) (Min):150mΩ Resistance - Post Trip (R1) (Max):700mΩ Time to Trip(Max):- Operating Temperature:-40℃~+85℃ Operating Temperature:-40℃~+85℃ Length:- Width:- Height:- Pitch; LCSC Part Name: 0.5A 13.2V 自恢复保险丝; Supplier Part: C75464; Manufacturer: BOURNS; Supplier Footprint: 1206; Datasheet: https://item.szlcsc.com/datasheet/MF-NSMF050-2/76588.html; Supplier: LCSC; Hold Current: 0.5A Hold; Resistance - Initial (Ri) (Min): 150mΩ; Resistance - Post Trip (R1) (Max): 700mΩ; Operating Temperature: -40℃~+85℃
SW1 = SS-22F07-G100: LCSC Part Name: 拨动开关SS-22F07 柄高10mm; Supplier Part: C5446810; Manufacturer: G-Switch(品赞); Supplier Footprint: 插件,17x7.5mm; Datasheet: https://item.szlcsc.com/datasheet/SS-22F07-G100/6342984.html; Supplier: LCSC; Circuit: DPDT; Actuator Style: Rectangular Columnar; Termination Style: PC Pin; Length: 17mm; Width: 7.5mm; Switch Height: 18.5mm; Mounting Type: Through Hole; Actuator Color: Black; Current Rating: 1A; Voltage Rating: 24V; Life: 10,000 Cycles; Operating Temperature: -25℃~+70℃
U3-U14 = AT172-CuH-S: LCSC Part Name: 固态继电器; Supplier Part: C20624244; Manufacturer: AOTE(奥特); Supplier Footprint: SOP-4; Datasheet: https://item.szlcsc.com/datasheet/AT172-CuH-S/22024883.html; Supplier: LCSC; Load Current: 500mA; Load Voltage: 60V; Voltage - Forward(Vf): 1.4V; Forward Current(If): 50mA; RDS(on): 1.5Ω; Isolation Voltage(Vrms): 3.75kV; Turn-on time: 2ms; Turn-off time: 1ms; Input Type: AC,DC; Operating Temperature: -40℃~+85℃; Insulation Resistance: 1000MΩ
CN1 = DR-9M: LCSC Part Name: 常规D-Sub 公 P数:9P; Supplier Part: C3020655; Manufacturer: ZHOURI(洲日); Supplier Footprint: 插件; JLCPCB Part Class: Extended Part; Datasheet: https://item.szlcsc.com/datasheet/DR-9M/3543029.html; Supplier: LCSC; Connector Type: Standard D-Sub; Gender: Male; Number of Pins: 9P; Mounting Type: Right Angle; Number of Rows: 2; Current Rating-Signal: 2A; Operating Temperature: -45℃~+105℃; Note: Laser
CN2 = DR-9F: LCSC Part Name: 常规D-Sub 母 P数:9P; Supplier Part: C3020657; Manufacturer: ZHOURI(洲日); Supplier Footprint: 插件; Datasheet: https://item.szlcsc.com/datasheet/DR-9F/3543125.html; Supplier: LCSC; Connector Type: Standard D-Sub; Gender: Female; Number of Pins: 9P; Mounting Type: Right Angle; Number of Rows: 2; Current Rating-Signal: 2A; Operating Temperature: -45℃~+105℃; Note: Extractor
C24 C25 = CL10C150JB8NNNC: LCSC Part Name: 15pF ±5% 50V; Supplier Part: C1644; Manufacturer: SAMSUNG(三星); Supplier Footprint: 0603; JLCPCB Part Class: Basic Part; Datasheet: https://item.szlcsc.com/datasheet/CL10C150JB8NNNC/1996.html; Supplier: LCSC; Tolerance: ±5%; Voltage Rating: 50V; Temperature Coefficient: C0G
F3 F4 = MF-NSMF050-2: Voltage - Max:- Current - Max:- Hold Current:- Trip Current:- Resistance - Initial (Ri) (Min):150mΩ Resistance - Post Trip (R1) (Max):700mΩ Time to Trip(Max):- Operating Temperature:-40℃~+85℃ Operating Temperature:-40℃~+85℃ Length:- Width:- Height:- Pitch; LCSC Part Name: 0.5A 13.2V 自恢复保险丝; Supplier Part: C75464; Manufacturer: BOURNS; Supplier Footprint: 1206; Datasheet: https://item.szlcsc.com/datasheet/MF-NSMF050-2/76588.html; Supplier: LCSC; Resistance - Initial (Ri) (Min): 150mΩ; Resistance - Post Trip (R1) (Max): 700mΩ; Operating Temperature: -40℃~+85℃
H1 = HDR-M_2.54_1x4P: Supplier Footprint: Through
H2 = HDR-F_2.54_2x3: ICSP Header; Supplier Footprint: Through
LED1 = KT-0603R: LCSC Part Name: 0603 红灯 高亮; Supplier Part: C2286; Manufacturer: KENTO; Supplier Footprint: 0603; Datasheet: https://atta.szlcsc.com/upload/public/pdf/source/20160616/1466072038404.pdf; Supplier: LCSC; Emitted Color: Red; Operating Temperature: -40℃~+85℃
U22 = ATMEGA328PB-AU: Supplier Part: C132230; Manufacturer: MICROCHIP(美国微芯); Supplier Footprint: TQFP-32(7x7); Datasheet: https://item.szlcsc.com/datasheet/ATMEGA328PB-AU/143529.html; Supplier: LCSC; CPU Core: AVR; CPU Maximum Speed: 20MHz; Core Size: 8 Bit; Program Storage Size: 32KB; Program Memory Type: FLASH; RAM Size: 2KB; EEPROM: 1KB; Number of I/O: 27; ADC (Bit): 10bit; Oscillator Type: Built-in; Voltage - Supply: 1.8V~5.5V; Operating Temperature: -40℃~+85℃
X1 = X322516MLB4SI: LCSC Part Name: YSX321SL 16MHZ 4P 3225 9PF ±10PPM -40~85℃ (±20PPM); Supplier Part: C13738; Manufacturer: YXC(扬兴晶振); Supplier Footprint: SMD3225-4P; JLCPCB Part Class: Basic Part; Datasheet: https://item.szlcsc.com/datasheet/X322516MLB4SI/14393.html; Supplier: LCSC; Type: Crystal Oscillator; Normal temperature Frequency Tolerance: ±10ppm; Load Capacitance: 9pF; Frequency Stability: ±20ppm; Operating Temperature: -40℃~+85℃
C1 C5 = CL10A106MA8NRNC: LCSC Part Name: 10uF ±20% 25V; Supplier Part: C96446; Manufacturer: SAMSUNG(三星); Supplier Footprint: 0603; JLCPCB Part Class: Basic Part; Datasheet: https://item.szlcsc.com/datasheet/CL10A106MA8NRNC/97651.html; Supplier: LCSC; Tolerance: ±20%; Voltage Rating: 25V; Temperature Coefficient: X5R
L1 = CMI321609X100KT: LCSC Part Name: 10uH ±10%; Supplier Part: C1051; Manufacturer: FH(风华); Supplier Footprint: 1206; Datasheet: https://item.szlcsc.com/datasheet/CMI321609X100KT/1403.html; Supplier: LCSC; Tolerance: ±10%; Current Rating: 25mA; DC Resistance(DCR): 800mΩ; Q @ Frequency: 35@2MHz; Frequency - Self Resonant: 24MHz
Q1 = MMBT4403_C20069140: LCSC Part Name: hFE:100-300 PNP 电流:600mA 电压:40V; Supplier Part: C20069140; Manufacturer: R+O(宏嘉诚); Supplier Footprint: SOT-23; JLCPCB Part Class: Extended Part; Datasheet: https://item.szlcsc.com/datasheet/MMBT4403/21397178.html; Supplier: LCSC; type: PNP; Current - Collector(Ic): 600mA; Collector - Emitter Voltage VCEO: 40V; Pd - Power Dissipation: 300mW; DC Current Gain: 100@10mA,1.0V; Transition frequency(fT): 200MHz; Current - Collector Cutoff: 100nA; Vce Saturation(VCE(sat)): 400mV; Operating Temperature: -55℃~+150℃; Emitter-Base Voltage(Vebo): 5V
R1 = 0603WAF2002T5E: LCSC Part Name: 20kΩ ±1% 100mW 厚膜电阻; Supplier Part: C4184; Manufacturer: UNI-ROYAL(厚声); Supplier Footprint: 0603; Datasheet: https://item.szlcsc.com/datasheet/0603WAF2002T5E/4591.html; Supplier: LCSC; Type: Thick Film Resistor; Tolerance: ±1%; Power(Watts): 100mW; Voltage-Supply(Max): 75V; Temperature Coefficient: ±100ppm/℃; Operating Temperature: -55℃~+155℃
R2 = 0603WAF8201T5E: LCSC Part Name: 8.2kΩ ±1% 100mW 厚膜电阻; Supplier Part: C25981; Manufacturer: UNI-ROYAL(厚声); Supplier Footprint: 0603; JLCPCB Part Class: Basic Part; Datasheet: https://item.szlcsc.com/datasheet/0603WAF8201T5E/26724.html; Supplier: LCSC; Type: Thick Film Resistor; Tolerance: ±1%; Power(Watts): 100mW; Voltage-Supply(Max): 75V; Temperature Coefficient: ±100ppm/℃; Operating Temperature: -55℃~+155℃
R3 R4 = 0603WAF1000T5E: LCSC Part Name: 100Ω ±1% 100mW 厚膜电阻; Supplier Part: C22775; Manufacturer: UNI-ROYAL(厚声); Supplier Footprint: 0603; JLCPCB Part Class: Basic Part; Datasheet: https://atta.szlcsc.com/upload/public/pdf/source/20200306/C422600_1E6D84923E4A46A82E41ADD87F860B5C.pdf; Supplier: LCSC; Type: Thick Film Resistors; Tolerance: ±1%; Temperature Coefficient: ±200ppm/℃; Operating Temperature Range: -55℃~+155℃
U1 = HX711_C6705483: LCSC Part Name: 用于称重秤的24bit 模数转换器（ADC）; Supplier Part: C6705483; Manufacturer: AVIA(海芯科技); Supplier Footprint: SOP-16; JLCPCB Part Class: Extended Part; Datasheet: https://item.szlcsc.com/datasheet/HX711/7662293.html; Supplier: LCSC; Resolution(Bits): 24; Sampling Rate: 80Hz；10Hz; number of channels: 2; Voltage - Supply: 2.6V~5.5V; Interface: SPI; differential input: Yes; Operating Temperature: -40℃~+85℃; Clock/Oscillator: Built-in；External; Clock Frequency: 1MHz~20MHz；11.0592MHz; Voltage Reference: Built-in; Programmable Gain: Support; Quiescent Current (Iq): 1.4mA; Full-Scale Range(FSR): 20mV；40mV；80mV
U2 = WF100SPZ 2BG D6 AT: LCSC Part Name: 模拟气压传感器 量程200KPa; Supplier Part: C2886644; Manufacturer: WF(伟烽); Supplier Footprint: DIP-6; JLCPCB Part Class: Extended Part; Datasheet: https://atta.szlcsc.com/upload/public/pdf/source/20210827/DFC0645FD8FCB35370A9A5FE22103645.pdf; Supplier: LCSC
CN4 = 921-111A1010D10200: Connector Type:Type-B Protocol Standard:USB 2.0 Gender:Female Mounting Type:Right Angle Number of Contacts:4P Number of Ports:1 Length:16.3mm Detection color:White; LCSC Part Name: Type-B 母 弯插; Supplier Part: C46392; Manufacturer: 精拓金; Supplier Footprint: 插件; Datasheet: https://item.szlcsc.com/datasheet/921-111A1010D10200/47396.html; Supplier: LCSC; Connector Type: Type-B; Protocol Standard: USB 2.0; Gender: Female; Mounting Type: Right Angle; Number of Contacts: 4P; Number of Ports: 1; Length: 16.3mm; Detection color: White
U23 = CH340C_C7464026: LCSC Part Name: （SMT编带）人工转编带 USB转串口芯片CH340; Supplier Part: C7464026; Manufacturer: WCH(南京沁恒); Supplier Footprint: SOP-16; JLCPCB Part Class: Extended Part; Datasheet: https://item.szlcsc.com/datasheet/CH340C/8499789.html; Supplier: LCSC

## Nets
+5V: C1.2 C2.2 C3.2 C8.2 C9.2 C12.2 C14.2 C15.2 C16.2 C17.2 C20.2 C21.2 C22.2 C23.2 C26.2 C27.2 C28.2 C30.2 CN5.6 CN5.13 D5.5 D6.5 D7.1(K) D8.5 F1.2 F3.2 H2.2 Q1.2(E) R35.2 R37.2 U1.1(VSUP) U1.16(DVDD) U4.3 U6.3 U7.3 U9.3 U15.1(VCCA) U15.6(VCCB) U16.1(VCCA) U16.6(VCCB) U17.1(VCCA) U17.6(VCCB) U18.1(VCCA) U18.6(VCCB) U20.3(VDD) U22.4(VCC) U22.18(AVCC) U23.16(VCC) U24.5(OUT) U24.6(OUT) U24.7(OUT) U24.8(OUT)
+12V: C10.2 C11.2 C18.2 CN5.4 CN5.5 F2.1 R29.2 U19.5(OUT) U19.6(OUT) U19.7(OUT) U19.8(OUT) U21.1(IN)
GND: C1.1 C2.1 C3.1 C4.1 C5.1 C6.1 C8.1 C9.1 C10.1 C11.1 C12.1 C13.1 C14.1 C15.1 C16.1 C17.1 C18.1 C19.1 C20.1 C21.1 C22.1 C23.1 C24.1 C25.1 C26.1 C27.1 C28.1 C30.1 C31.1 C32.1 CN4.4(GND) CN5.3 CN5.10 CN5.11 CN5.14 CN5.16 CN5.17 D5.2 D6.2 D8.2 D9.2 DC1.2 DC1.3 H1.1 H2.6 R2.1 R7.1 R10.1 R13.1 R16.1 R22.2 R23.2 R24.2 R25.2 R30.1 R31.2 R32.2 R33.2 R34.2 R36.1 SW1.3 SW1.4 U1.5(AGND) U1.9(INNB) U1.10(INPB) U1.14(XI) U1.15(RATE) U2.1(GND) U2.6(GND) U3.2(K) U4.2(K) U5.2(K) U6.2(K) U7.2(K) U8.2(K) U9.2(K) U10.2(K) U11.2(K) U12.2(K) U13.2(K) U14.2(K) U15.2(GND) U16.2(GND) U17.2(GND) U18.2(GND) U19.2(GND) U20.5(GND) U21.4(GND) U22.5(GND) U22.21(GND) U23.1(GND) U24.2(GND) X1.2(GND) X1.4(GND)
VDDA: C4.2 C5.2 L1.1 U2.3(VS+)
BUSIO1: CN5.8 D5.6 R25.1 U15.4(B)
BUSIO2: CN5.9 D5.4 R22.1 U16.4(B)
BUSIO3: CN5.12 D5.3 R24.1 U17.4(B)
BUSIO4: CN5.15 D5.1 R23.1 U18.4(B)
BUZZER: CN3.4 U14.3
CTRL-BUZZER: R20.2 U22.25((ADC2/PTCY)PC2)
CTRL-GREEN: R19.2 U22.24((SCK1/ADC1/PTCY)PC1)
CTRL-RED: R17.2 U22.22(PE3(PTCY/ADC7/T3/MOSI1))
CTRL-YELLOW: R18.2 U22.23((MISO1/ADC0/PTCY)PC0)
CUSTOMIN+: CN1.6 D4.1(K)
CUSTOMIN-: CN1.7 R14.2
CUSTOMOUT+: CN2.6 U10.3
CUSTOMOUT-: CN2.7 U10.4
CUSTOMREAD: R15.2 R16.2 U9.4 U22.1((OC2B/INT1/PTCXY)PD3)
D+: CN4.3(D+) D9.3 D9.4 U23.5(UD+)
D-: CN4.2(D-) D9.1 D9.6 U23.6(UD-)
ERRIN+: CN2.1 D1.1(K)
ERRIN-: CN2.2 R6.1
ERROUT+: CN1.1 U3.3
ERROUT-: CN1.2 U3.4
ERRREAD: R5.2 R7.2 U4.4 U22.32((OC3B/OC4B/INT0/PTCXY)PD2)
GPIO1: H2.4 R21.2 U22.15((MOSI0/TXD1/OC2A/PTCXY)PB3)
GPIO2: H2.1 R26.2 U22.16((MISO0/RXD1/PTCXY)PB4)
GPIO3: R27.2 U22.3(PE0(PTCXY/SDA1/ICP4/ACO))
GPIO4: R28.2 U22.9((OC0B/T1/PTCXY)PD5)
GREEN: CN3.3 U13.3
INTERRUPT: CN5.7 D6.1 D6.6 U22.11((AIN1/PTCXY)PD7)
IODIR1: R31.1 U15.5(DIR) U22.12((CLKO/ICP1/PTCXY)PB0)
IODIR2: R32.1 U16.5(DIR) U22.19(PE2(PTCY/ADC6/ICP3/SS1))
IODIR3: R33.1 U17.5(DIR) U22.6(PE1(PTCXY/SCL1/T4))
IODIR4: R34.1 U18.5(DIR) U22.10((OC0A/AIN0/PTCXY)PD6)
LPIN+: CN2.8 D2.1(K)
LPIN-: CN2.9 R9.1
LPOUT+: CN1.8 U5.3
LPOUT-: CN1.9 U5.4
LPREAD: R8.2 R10.2 U6.4 U22.26((ADC3/PTCY)PC3)
ONEWIRE: CN5.2 D6.3 D6.4 U20.4(DQ)
PDAT: U1.12(DOUT) U22.13((OC1A/PTCXY)PB1)
PSCK: U1.11(PD_SCK) U22.14((OC1B/SS0/PTCXY)PB2)
RED: CN3.1 U11.3
RESET: C29.1 D8.6 H2.5 R35.1 U22.29((RESET#)PC6)
RETURN: CN3.5 SW1.5
RX: U22.30((RXD0/OC3A/PTCXY)PD0) U23.2(TXD)
SCK: H2.3 LED1.2(A) U22.17((XCK0/SCK0/PTCXY)PB5)
SCL: H1.4 U22.28((SCL0/ADC5/PTCY)PC5)
SDA: H1.3 U22.27((SDA0/ADC4/PTCY)PC4)
SHIELD: CN1.10(MH1) CN1.11(MH2) CN2.10(MH1) CN2.11(MH2)
SOURCE: SW1.2 U11.4 U12.4 U13.4 U14.4
STARTIN+: CN1.4 D3.1(K)
STARTIN-: CN1.5 R11.2
STARTOUT+: CN2.4 U8.3
STARTOUT-: CN2.5 U8.4
STARTREAD: R12.2 R13.2 U7.4 U22.2((XCK0/T0/PTCXY)PD4)
TX: U22.31((TXD0/OC4A/PTCXY)PD1) U23.3(RXD)
VE+: R4.2 U2.2(VOUT+)
VE-: R3.2 U2.5(VOUT-)
VEXT: D1.2(A) D2.2(A) D3.2(A) D4.2(A) F1.1
VLED: F2.2 SW1.1 SW1.6
VUSB: CN4.1(VCC) D9.5 F4.2
XTAL+: C25.2 U22.7((XTAL1/TOSC1)PB6) X1.1(OSC1)
XTAL-: C24.2 U22.8((XTAL2/TOSC2)PB7) X1.3(OSC2)
YELLOW: CN3.2 U12.3
$2N607: Q1.1(B) U1.2(BASE)
$2N993: C7.1 R4.1 U1.8(INPA)
$2N998: C7.2 R3.1 U1.7(INNA)
$2N1066: C6.2 U1.6(VBG)
$2N1160: R1.1 R2.2 U1.4(VFB)
$2N1353: L1.2 Q1.3(C) R1.2 U1.3(AVDD)
$3N469: R5.1 U3.1
$3N884: R8.1 U5.1
$3N1152: R11.1 U7.1
$3N1252: R14.1 U9.1
$3N2257: R15.1 U10.1
$3N2409: R12.1 U8.1
$3N2770: R9.2 U6.1
$3N3166: R6.2 U4.1
$4N697: R17.1 U11.1
$4N831: R18.1 U12.1
$4N944: R19.1 U13.1
$4N1057: R20.1 U14.1
$5N1499: R26.1 U16.3(A)
$5N1502: R21.1 U15.3(A)
$5N2548: DC1.1 U19.3(IN) U19.4(IN)
$5N2550: C13.2 R29.1 U19.1(VS)
$5N2785: C19.2 D7.2(A) R30.2 U21.3(OUT)
$5N4471: R27.1 U17.3(A)
$5N4479: R28.1 U18.3(A)
$6N849: F3.1 H1.2
$6N1472: LED1.1(K) R36.2
$7N484: F4.1 U24.3(IN) U24.4(IN)
$7N486: C32.2 R37.1 U24.1(VS)
$7N1108: C31.2 U23.4(V3)
$7N1197: C29.2 U23.13(DTR#)

Not connected (* = marked no-connect by the designer): CN1 3*; CN2 3*; CN4 5(SH1)* 6(SH2)*; CN5 1*; D8 1* 3* 4*; SW1 7* 8*; U1 13(XO)*; U2 4(NC)*; U20 1(NC)* 2(NC)* 6(NC)* 7(NC)* 8(NC)*; U22 20(AREF)*; U23 7(NC.)* 8(OUT#)* 9(CTS#)* 10(DSR#)* 11(RI#)* 12(DCD#)* 14(RTS#)* 15(R232)*

## Notes on the sheets
sheet 1
- Laser Monitor
- Monitors air pressure, extractor status to keep laser safe
- Flashes warning lights, alarm if air or extractor not functioning
- Intercepts the DB9 fume control line
- Read when cut starts by extractor on signal
- Reads extractor state by fault, low pressure signals
- Air pressure transducer for air assist line
- Green-yellow-red andon setup
- GREEN: Everything OK
- YELLOW: Idle, or flashing if spooling up
- RED: Flashing, issue present
- V1.0.1 Changes:
- Flipped incorrect DB9 pinout to fume extractor
- Near 1
- Near 1
- Near 16
- 2BG = 200KPA (29PSI)
- Full scale output is 80mV
- HX711 max input is 40mV
- Equivelant to reading 0-15PSI
- 0 output drift is +/- 15mV
- We aren't trying to measure the actual
  pressure, just if there is pressure present
sheet 2
- Signals are passed through independent of MCU
- CN2 flipped properly in V1.0.1
- https://support.epiloglaser.com/laser-machine/fusion-edge/system-requirements-setup/filter-control-connection-guide/
sheet 3
- Switch to go between NPN and PNP control
sheet 4
- ACS Interface is optional, allows critical faults to be reported to the server.
- Replaces onboard LDO with high-efficency stepdown as well
- When DIR is High, A goes to B
- Bus GPIO Transceivers
- DIR referenced to VCCA
- Bus 15P Connection
- 12V Barrel Jack Input
- OneWire Temperature & EEPROM
- 12V to 5V Backup Regulator
- Default: Bus GPIO are inputs
sheet 5
- Connector for external i2C Display
- Ex: HT16K33 4 character, 14 segment
- Ex: 1602 LCD Screen with i2C Backpack
- ICSP pins re-used as bus GPIO
- To take advantage of UART1
- RX/TX Flipped at USB
- Clamp reset between 0 and 5v
- Re-use ESD diode to reduce unique part count
sheet 6
- USB-UART Bridge
- USB Port, PolyFuse, Ideal Diode
